# EAGLE design dip_version_ser_io_crystal_bold_02 (EAGLE 5.06)
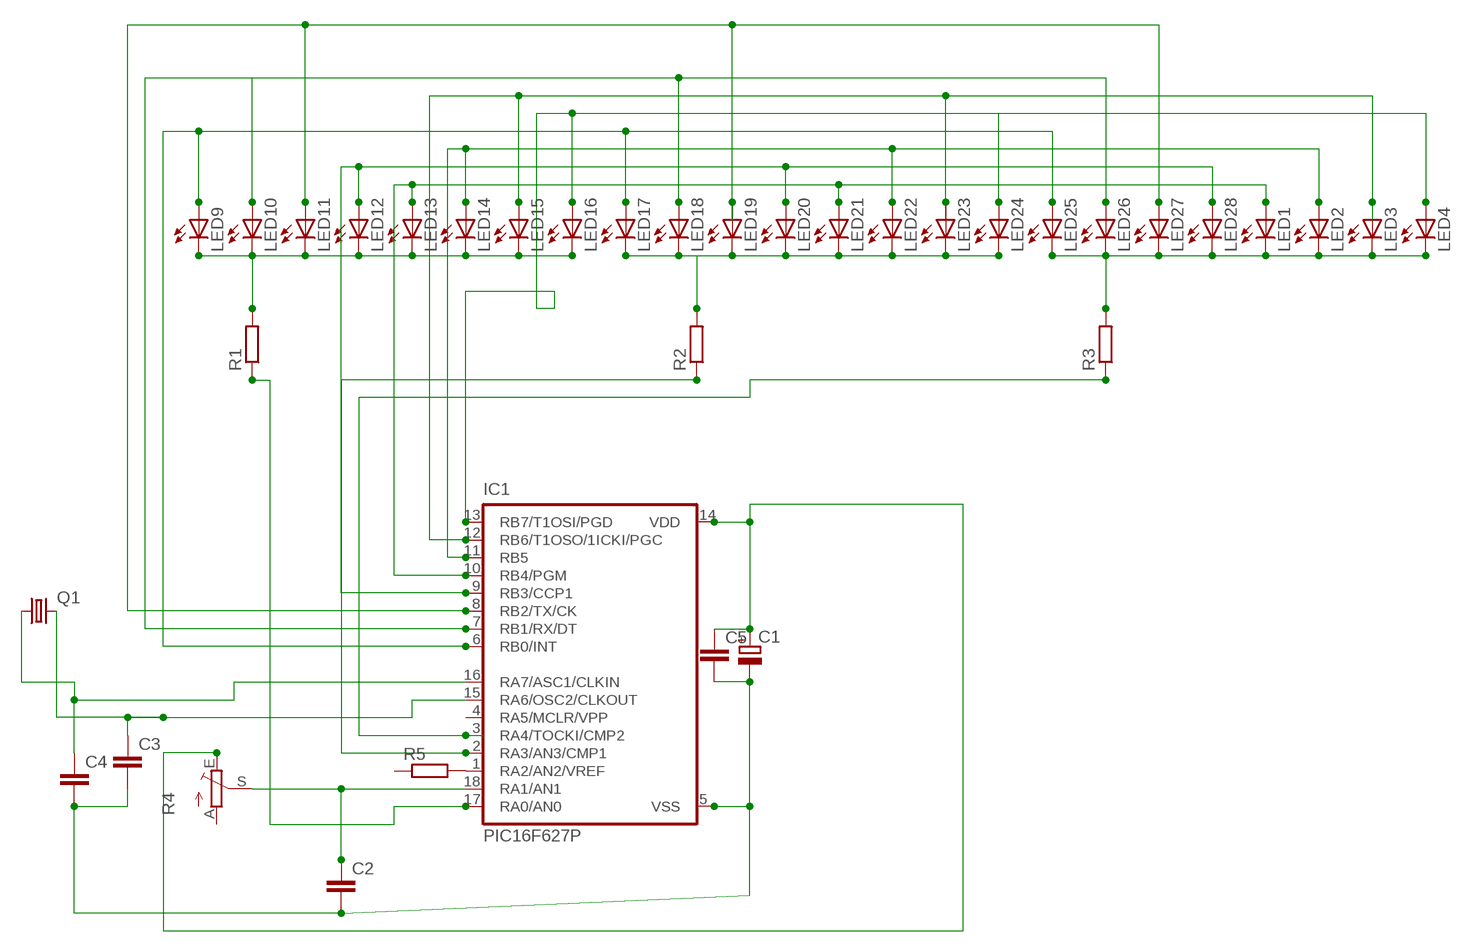
[diagram p0: schematic, sheet 1]

## Parts
C1  CPOL-EUTT6D6  [TT5D6]
C2  C-EU050-030X075  [C050-030X075]
C3  C5/2.5  [C5B2.5]
C4  C5/2.5  [C5B2.5]
C5  C7.5/4  [C7.5B4]
IC1  PIC16F627P  [DIL18]
LED1  LED5MM  [LED5MM]
LED2  LED5MM  [LED5MM]
LED3  LED5MM  [LED5MM]
LED4  LED5MM  [LED5MM]
LED9  LED5MM  [LED5MM]
LED10  LED5MM  [LED5MM]
LED11  LED5MM  [LED5MM]
LED12  LED5MM  [LED5MM]
LED13  LED5MM  [LED5MM]
LED14  LED5MM  [LED5MM]
LED15  LED5MM  [LED5MM]
LED16  LED5MM  [LED5MM]
LED17  LED5MM  [LED5MM]
LED18  LED5MM  [LED5MM]
LED19  LED5MM  [LED5MM]
LED20  LED5MM  [LED5MM]
LED21  LED5MM  [LED5MM]
LED22  LED5MM  [LED5MM]
LED23  LED5MM  [LED5MM]
LED24  LED5MM  [LED5MM]
LED25  LED5MM  [LED5MM]
LED26  LED5MM  [LED5MM]
LED27  LED5MM  [LED5MM]
LED28  LED5MM  [LED5MM]
Q1  CRYSTALHC49U-LM  [HC49U-LM]
R1  R-EU_0204/7  [0204/7]
R2  R-EU_0204/7  [0204/7]
R3  R-EU_0204/7  [0204/7]
R4  TRIM_EU-S43P  [SP19L]
R5  R-EU_0207/15  [0207/15]

## Nets
N$1: LED9.K(C) LED10.K(C) LED11.K(C) LED12.K(C) LED13.K(C) LED14.K(C) LED15.K(C) LED16.K(C) R1.2
N$2: IC1.6(RB0/INT) LED9.A LED17.A LED25.A
N$3: LED17.K(C) LED18.K(C) LED19.K(C) LED20.K(C) LED21.K(C) LED22.K(C) LED23.K(C) LED24.K(C) R2.2
N$4: LED1.K(C) LED2.K(C) LED3.K(C) LED4.K(C) LED25.K(C) LED26.K(C) LED27.K(C) LED28.K(C) R3.2
N$5: IC1.8(RB2/TX/CK) LED11.A LED19.A LED27.A
N$7: IC1.9(RB3/CCP1) LED12.A LED20.A LED28.A
N$8: IC1.10(RB4/PGM) LED1.A LED13.A LED21.A
N$9: IC1.11(RB5) LED2.A LED14.A LED22.A
N$10: IC1.12(RB6/T1OSO/1ICKI/PGC) LED3.A LED15.A LED23.A
N$11: IC1.13(RB7/T1OSI/PGD) LED4.A LED16.A LED24.A
N$12: IC1.17(RA0/AN0) R1.1
N$13: IC1.2(RA3/AN3/CMP1) R2.1
N$14: IC1.3(RA4/TOCKI/CMP2) R3.1
N$16: C1.+ C5.1 IC1.14(VDD) R4.E
N$17: C2.1 IC1.18(RA1/AN1) R4.S
N$18: IC1.1(RA2/AN2/VREF) R5.2
N$19: C4.1 IC1.16(RA7/ASC1/CLKIN) Q1.1
N$20: C3.1 IC1.15(RA6/OSC2/CLKOUT) Q1.2
N$21: IC1.7(RB1/RX/DT) LED10.A LED18.A LED26.A
N$31: C1.- C2.2 C3.2 C4.2 C5.2 IC1.5(VSS)
Unconnected: IC1.4(RA5/MCLR/VPP) R4.A R5.1

## Library data of the parts
C1 = rcl:CPOL-EU: POLARIZED CAPACITOR, European symbol
C2 = rcl:C-EU: CAPACITOR, European symbol
C3-C5 = capacitor-wima:C: CAPACITOR naming: grid - package width
IC1 = microchip:PIC16*F62: FLASH-Based 8-Bit CMOS Microcontroller Source: http://ww1.microchip.com/downloads/en/DeviceDoc/40300C.pdf
LED1-LED4 LED9-LED28 = led:LED: LED OSRAM: - CHIPLED LG R971, LG N971, LY N971, LG Q971, LY Q971, LO R971, LY R971 LH N974, LH R974 LS Q976, LO Q976, LY Q976 LO Q996 - Hyper CHIPLED LW Q18S LB Q993, LB Q99A, LB R99A - SideLED LS A670, LO A670, LY A670, LG A670, LP A670 LB A673, LV A673, LT A673, LW A673 LH A674 LY A675 LS A676, LA A676, LO A676, LY A676, LW A676 LS A679, LY A679, LG A679 - Hyper Micro SIDELED® LS Y876, LA Y876, LO Y876, LY Y876 LT Y87S - SmartLED LW L88C, LW L88S LB L89C, LB L89S, LG L890 LS L89K, LO L89K, LY L89K LS L896, LA L896, LO L896, LY L896 - TOPLED LS T670, LO T670, LY T670, LG T670, LP T670 LSG T670, LSP T670, LSY T670, LOP T670, LYG T670 LG T671, LOG T671, LSG T671 LB T673, LV T673, LT T673, LW T673 LH T674 LS T676, LA T676, LO T676, LY T676, LB T676, LH T676, LSB T676, LW T676 LB T67C, LV T67C, LT T67C, LS T67K, LO T67K, LY T67K, LW E67C LS E67B, LA E67B, LO E67B, LY E67B, LB E67C, LV E67C, LT E67C LW T67C LS T679, LY T679, LG T679 LS T770, LO T770, LY T770, LG T770, LP T770 LB T773, LV T773, LT T773, LW T773 LH T774 LS E675, LA E675, LY E675, LS T675 LS T776, LA T776, LO T776, LY T776, LB T776 LHGB T686 LT T68C, LB T68C - Hyper Mini TOPLED® LB M676 - Mini TOPLED Santana® LG M470 LS M47K, LO M47K, LY M47K Source: http://www.osram.convergy.de LUXEON: - LUMILED® LXK2-PW12-R00, LXK2-PW12-S00, LXK2-PW14-U00, LXK2-PW14-V00 LXK2-PM12-R00, LXK2-PM12-S00, LXK2-PM14-U00 LXK2-PE12-Q00, LXK2-PE12-R00, LXK2-PE12-S00, LXK2-PE14-T00, LXK2-PE14-U00 LXK2-PB12-K00, LXK2-PB12-L00, LXK2-PB12-M00, LXK2-PB14-N00, LXK2-PB14-P00, LXK2-PB14-Q00 LXK2-PR12-L00, LXK2-PR12-M00, LXK2-PR14-Q00, LXK2-PR14-R00 LXK2-PD12-Q00, LXK2-PD12-R00, LXK2-PD12-S00 LXK2-PH12-R00, LXK2-PH12-S00 LXK2-PL12-P00, LXK2-PL12-Q00, LXK2-PL12-R00 Source: www.luxeon.com KINGBRIGHT: KA-3528ASYC Source: www.kingbright.com
Q1 = crystal:CRYSTAL: CRYSTAL
R1-R3 R5 = resistor:R-EU_: RESISTOR, European symbol
R4 = pot:TRIM_EU-: POTENTIOMETER

## Board
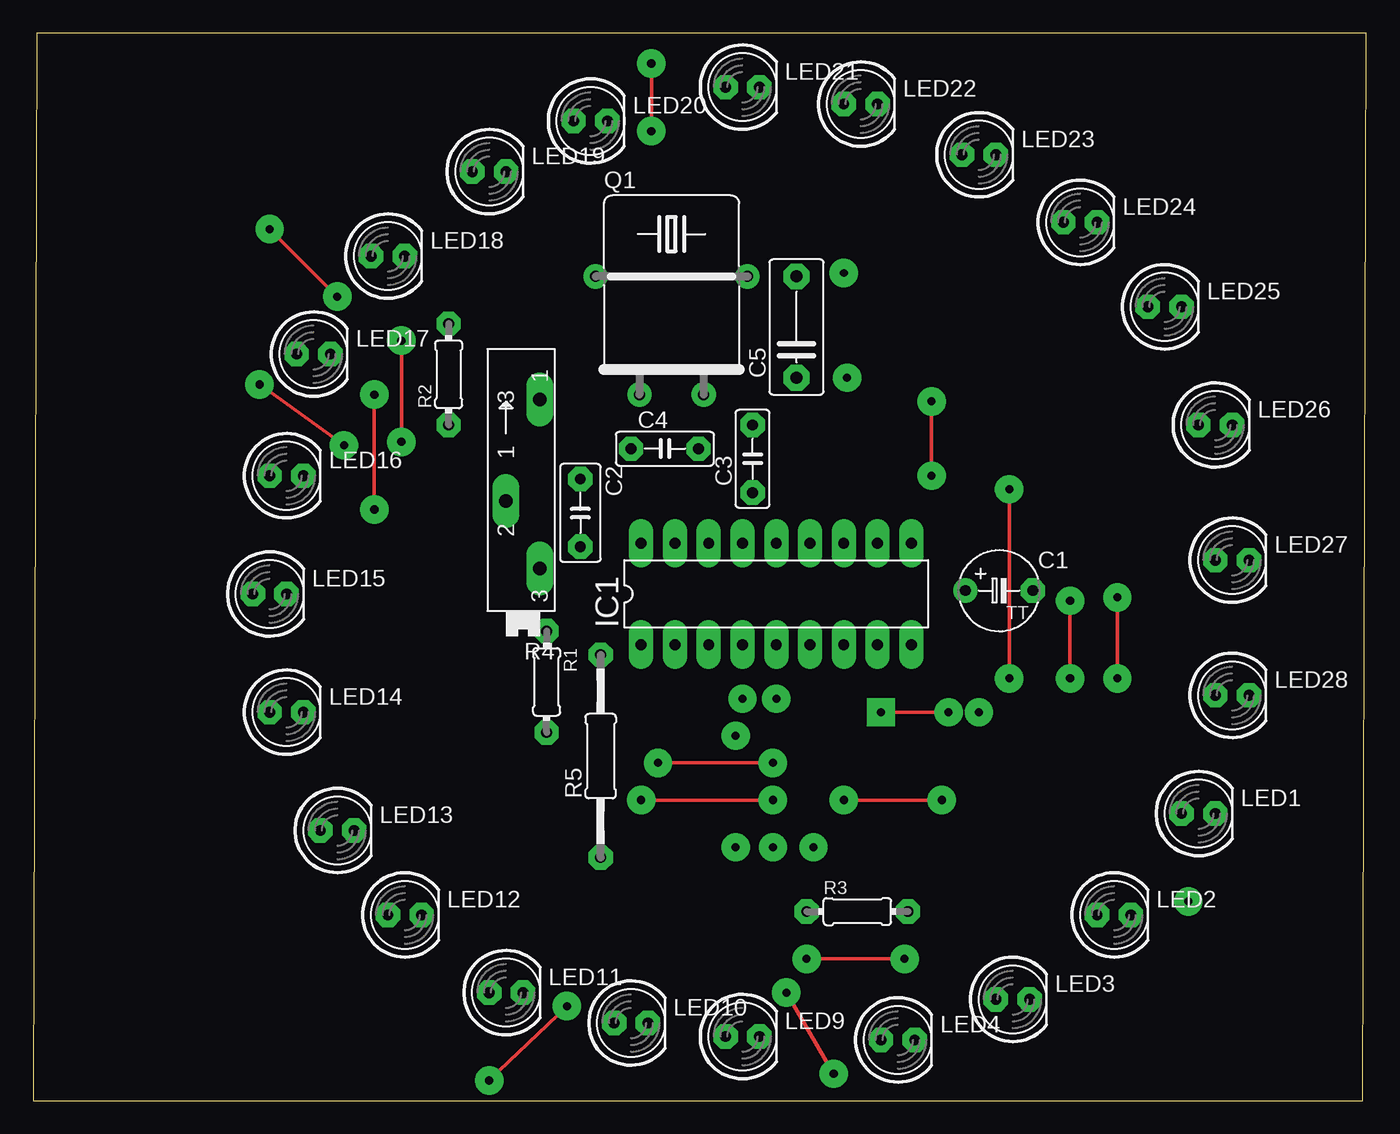
[diagram p1: board, top side]
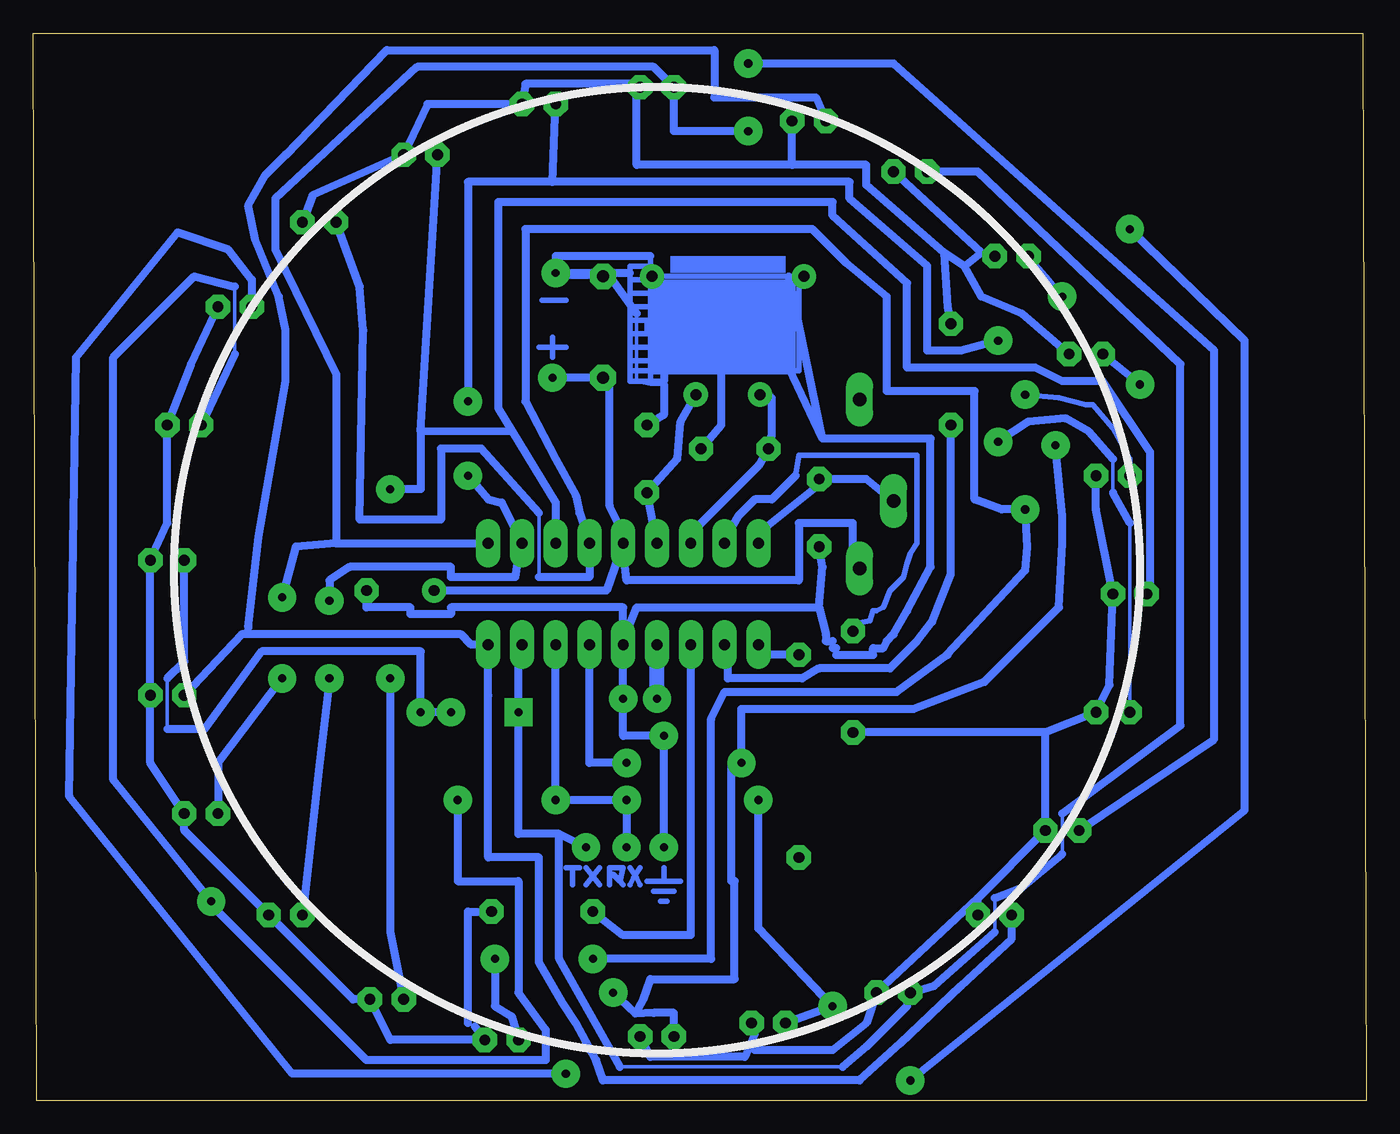
[diagram p2: board, bottom side, seen from below]

Size 100.25 x 80.25 mm. Coordinates in mm from the lower left corner, seen from the top.
Outline: 0,0 100,0 100.25,80.25 0.25,80.25 0,0
Copper layers (1*16): Top 0.035mm / dielectric 1.5mm / Bottom 0.035mm
Design rules "default *": minimum track width 10mil, minimum drill 24mil, track to track 8mil, track to pad 8mil, pad to pad 8mil, via to via 8mil, smd to smd 8mil, copper to edge 40mil, drill to drill 8mil, minimum pad ring 20mil, minimum via ring 30mil, stop-mask expansion 4mil, vias tented up to drill 0mil, thermal gap 10mil

### Footprints (pad centres in the part's own frame; a part is rotated, then mirrored left to right if it is on the bottom)
TT5D6 = drill 0.813 round: + -2.54,0 | drill 0.813 octagon: - 2.54,0
C050-030X075 = drill 0.813 octagon: 1 -2.54,0; 2 2.54,0
C5B2.5 = drill 0.813 pad 1.6 octagon: 1 -2.54,0; 2 2.54,0
C7.5B4 = drill 0.914 pad 1.905 octagon: 1 -3.81,0; 2 3.81,0
DIL18 = drill 0.813 long: 1 -10.16,-3.81; 2 -7.62,-3.81; 3 -5.08,-3.81; 4 -2.54,-3.81; 5 0,-3.81; 6 2.54,-3.81; 7 5.08,-3.81; 8 7.62,-3.81; 9 10.16,-3.81; 10 10.16,3.81; 11 7.62,3.81; 12 5.08,3.81; 13 2.54,3.81; 14 0,3.81; 15 -2.54,3.81; 16 -5.08,3.81; 17 -7.62,3.81; 18 -10.16,3.81
LED5MM = drill 0.813 octagon: A -1.27,0; K 1.27,0
HC49U-LM = drill 0.813 round: 1 -2.413,-5.08; 2 2.413,-5.08; M -5.715,3.81; M1 5.715,3.81
0204/7 = drill 0.813 octagon: 1 -3.81,0; 2 3.81,0
SP19L = drill 1.016 long: A 5.715,-1.27; E -6.985,-1.27; S -1.905,1.27
0207/15 = drill 0.813 octagon: 1 -7.62,0; 2 7.62,0

### Placement (x,y rotation side)
C1  72.64,38.35 0 top
C2  41.15,44.2 270 top
C3  54.1,48.26 90 top
C4  47.5,49.02 0 top
C5  57.4,58.17 90 top
IC1  55.88,38.1 0 top
LED1  87.63,21.59 0 top
LED2  81.28,13.97 0 top
LED3  73.66,7.62 0 top
LED4  65.02,4.57 0 top
LED9  53.34,4.83 0 top
LED10  44.96,5.84 0 top
LED11  35.56,8.13 0 top
LED12  27.94,13.97 0 top
LED13  22.86,20.32 0 top
LED14  19.05,29.21 0 top
LED15  17.78,38.1 0 top
LED16  19.05,46.99 0 top
LED17  21.08,56.13 0 top
LED18  26.67,63.5 0 top
LED19  34.29,69.85 0 top
LED20  41.91,73.66 0 top
LED21  53.34,76.2 0 top
LED22  62.23,74.93 0 top
LED23  71.12,71.12 0 top
LED24  78.74,66.04 0 top
LED25  85.09,59.69 0 top
LED26  88.9,50.8 0 top
LED27  90.17,40.64 0 top
LED28  90.17,30.48 0 top
Q1  48.01,58.17 0 top
R1  38.61,31.5 270 top
R2  31.24,54.61 90 top
R3  61.98,14.22 0 top
R4  36.83,46.99 90 top
R5  42.67,25.91 90 top

### Tracks (layer width: path | path; a pad name or v marks a point on that pad's centre or on a via)
N$1
  Bottom 0.254: 45.97,3.81 45.97,5.08
  Bottom 0.61: LED12.K 29.21,15.24 | 29.21,15.24 LED13.K 24.13,27.69 | 29.21,15.24 LED11.K 37.59,5.84 40.13,3.81 45.97,3.81 | 24.13,27.69 LED14.K 19.3,31.24 LED15.K 20.32,44.45 LED16.K | 24.13,27.69 R1.2 | LED9.K 53.85,3.3 46.74,3.3 45.97,5.08 LED10.K
N$2  (via drill 0.61)
  Top 0.254: v23.37,49.28 v17.02,53.85 | v46.99,25.4 v55.63,25.4 | v56.64,8.13 v60.2,2.03
  Bottom 0.254: 47.5,16.51 47.75,16.51
  Bottom 0.61: v17.02,53.85 LED17.A | IC1.6 58.42,25.4 v55.63,25.4 | v60.2,2.03 80.77,2.03 97.54,22.86 97.03,55.88 89.41,65.28 85.6,64.01 83.82,61.72 LED25.A | v23.37,49.28 22.86,43.94 22.86,41.91 23.11,37.08 28.7,31.5 34.04,29.46 46.99,29.46 v46.99,25.4 47.75,25.15 47.75,16.51 | 47.5,16.51 47.5,9.14 53.85,9.14 54.36,7.62 54.97,6.55 | 54.97,6.55 v56.64,8.13 | LED9.A 52.07,6.6 53.59,6.6 54.97,6.55
N$3
  Bottom 0.254: 28.96,63.75 LED18.K | 54.86,76.45 LED21.K
  Bottom 0.61: LED24.K 79.25,68.07 LED23.K 70.61,74.93 LED22.K 63.25,76.45 54.86,76.45 54.86,70.36 43.18,70.36 | LED17.K 25.91,59.18 28.96,60.45 30.23,62.74 | 30.23,62.74 28.96,63.75 LED19.K | 30.23,62.74 31.75,63.75 | 31.75,63.75 37.59,68.83 37.59,70.36 43.18,70.36 | 43.18,70.36 LED20.K | 31.75,63.75 31.5,59.69 R2.2
N$4
  Bottom 0.254: 67.06,5.59 67.56,5.84
  Bottom 0.61: LED25.K 88.39,55.37 LED26.K 90.17,43.43 LED27.K LED28.K 91.44,25.4 LED1.K 88.9,20.32 LED2.K 76.2,7.62 LED3.K 73.41,4.57 LED4.K 67.06,5.59 | 67.56,5.84 67.56,14.22 R3.2
N$5  (via drill 0.6, 0.6 pad 1.93, 0.61)
  Top 0.254: v63.75,29.21 v68.83,29.21
  Bottom 0.254: v63.75,29.21 IC1.8 | 22.86,18.54 22.86,21.59 | 27.94,12.7 27.94,15.24 | 90.17,27.94 90.17,31.75 | 37.59,4.06 37.67,4.14 | 39.37,2.54 56.13,2.54
  Bottom 0.61: LED19.A 29.21,69.85 13.97,55.37 13.97,28.19 22.86,21.59 | 22.86,18.54 25.91,16 27.94,15.24 | 27.94,12.7 32.51,8.64 LED11.A 34.54,7.11 37.59,4.06 39.37,2.54 | LED27.A 88.9,33.02 90.17,31.75 | 90.17,27.94 87.38,27.94 83.06,33.78 71.12,33.78 v71.12,29.21 v68.83,29.21 | IC1.8 63.75,33.53 v63.75,29.21 63.75,20.07 60.71,20.07 | 56.13,2.54 60.71,10.67 60.71,20.07 | 60.71,20.07 v58.67,19.05
N$6
  Bottom 0.406: 52.83,16.51 52.83,17.53 | 52.83,16.51 51.56,16.51 | 52.83,16.51 54.1,16.51
N$7
  Bottom 0.254: 84.58,35.05 84.07,35.56 | 81.28,71.12 81.25,71.08
  Bottom 0.61: LED28.A 84.58,35.05 68.07,35.05 67.31,34.29 IC1.9 66.04,30.48 66.04,18.29 62.23,18.29 62.23,10.41 60.45,7.37 59.44,5.84 57.91,3.05 57.4,1.52 38.1,1.52 35.05,4.32 30.48,8.64 26.67,12.19 LED12.A | 81.25,71.08 73.66,78.99 49.02,78.99 49.02,75.44 41.4,75.44 LED20.A | 81.28,71.12 82.8,69.6 84.07,67.31 83.57,64.77 81.79,60.45 81.28,57.91 81.28,54.1 83.31,42.42 84.07,35.56
N$8  (via drill 0.61)
  Top 0.254: v46.48,77.98 v46.48,72.9 | v81.53,37.85 v81.53,31.75
  Bottom 0.61: LED13.A 11.43,27.18 11.43,56.39 35.56,77.98 v46.48,77.98 | v46.48,72.9 52.07,72.9 LED21.A 53.59,77.72 71.37,77.72 82.04,67.82 82.04,64.01 77.47,54.61 77.47,41.91 | LED1.A 86.36,25.4 v81.53,31.75 | 77.47,41.91 IC1.10 | 77.47,41.91 80.52,41.66 v81.53,37.85
N$9  (via drill 0.61)
  Top 0.254: v77.98,37.59 v77.98,31.75 | v27.69,49.53 v27.69,57.15 | v67.56,52.58 v67.56,46.99
  Bottom 0.254: LED14.A 17.78,43.43 | 19.05,45.72 19.05,48.26
  Bottom 0.61: LED2.A 78.74,25.15 v77.98,31.75 | v67.56,46.99 66.04,45.21 65.02,44.96 IC1.11 63.75,41.15 64.01,39.37 68.83,39.37 68.83,40.13 76.45,40.13 77.98,39.12 v77.98,37.59 | 17.78,43.43 19.05,45.72 | 19.05,48.26 20.83,50.29 22.61,51.31 25.4,51.05 v27.69,49.53 | v67.56,52.58 67.56,69.09 61.21,69.09 | 61.21,69.09 LED22.A | 61.21,69.09 38.86,69.09 38.86,67.82 33.02,62.74 33.02,56.39 30.48,56.39 v27.69,57.15
N$10  (via drill 0.61)
  Top 0.254: v73.41,45.97 v73.41,31.75
  Bottom 0.254: 60.96,44.96 62.74,47.75 64.23,50.32 66.55,50.29 71.12,50.29 | LED15.A 16.26,38.61
  Bottom 0.61: LED3.A 73.41,12.7 v73.41,31.75 | 71.12,50.29 LED23.A | 64.23,50.32 71.12,50.29 | 16.26,38.61 16.26,48.77 19.81,54.1 22.86,54.1 24.89,55.12 34.54,55.12 34.54,61.47 40.13,66.55 40.13,67.56 65.28,67.56 65.28,52.07 60.96,44.96 IC1.12 | 71.12,50.29 71.12,45.97 v73.41,45.97
N$11  (via drill 0.61)
  Top 0.254: v25.65,44.45 v25.65,53.09 | v58.17,10.67 v65.53,10.67
  Bottom 0.254: 62.23,39.37 62.23,44.2 | 31.5,33.53 31.52,33.55
  Bottom 0.406: LED16.A 17.78,48.26 19.05,50.55 20.57,52.32 21.08,52.32 23.11,52.83 v25.65,53.09
  Bottom 0.61: v65.53,10.67 65.53,7.11 64.26,6.35 LED4.A | v58.17,10.67 49.28,10.67 49.28,28.7 48.26,30.73 35.31,30.73 31.5,33.53 | LED24.A 75.69,61.21 75.44,57.91 75.69,43.69 69.6,43.69 69.6,49.02 66.55,49.02 62.23,44.2 | 62.23,39.37 58.42,39.37 IC1.13 59.18,44.2 59.44,45.47 60.96,48.26 63.25,52.58 63.25,65.53 41.66,65.53 39.12,62.99 36.07,60.45 36.07,53.34 29.46,53.34 29.46,45.21 27.43,44.45 v25.65,44.45 25.5,41.63 25.65,39.88 31.52,33.55
N$12
  Bottom 0.406: 48.01,42.67 IC1.17 | 42.93,46.99 42.67,48.51 33.78,48.51 33.78,41.91 34.29,41.15 34.54,40.39 34.8,39.37 35.81,38.35 36.32,37.08 36.83,36.83 37.08,36.83 37.34,36.07 38.61,35.81 R1.1
  Bottom 0.61: 48.01,42.67 47.24,43.94 45.97,45.21 44.7,45.21 42.93,46.99
N$13
  Bottom 0.61: IC1.2 48.01,33.53 48.01,31.75 42.42,31.75 41.15,32.51 35.81,32.51 33.78,34.54 32.66,36 31.24,39.62 R2.1
N$14
  Bottom 0.61: IC1.3 50.8,12.45 55.88,12.45 R3.1
N$15
  Bottom 0.406: 60.2,56.64 62.23,56.64
N$16  (via drill 0.6 pad 1.93)
  Bottom 0.254: 55.88,41.66 IC1.14 | 56.9,53.85 C5.1
  Bottom 0.61: C1.+ 57.15,38.35 IC1.14 55.88,42.67 56.9,44.7 56.9,53.85 | 55.88,41.66 55.63,39.12 42.67,39.12 42.67,43.43 38.61,43.43 38.61,40.64 R4.E | C5.1 v61.21,54.36
N$17
  Bottom 0.254: 45.72,42.67 IC1.18 | 40.64,46.74 C2.1
  Bottom 0.61: 45.72,42.67 40.64,46.74 37.59,46.74 R4.S
N$18
  Bottom 0.61: R5.2 45.72,33.53 IC1.1
N$19
  Bottom 0.254: 50.8,42.67 IC1.16
  Bottom 0.61: Q1.1 44.7,52.83 44.7,50.04 C4.1 45.72,47.75 50.8,42.67
N$20
  Bottom 0.61: IC1.15 C3.1 51.82,48.26 51.56,51.05 Q1.2
N$21  (via drill 0.6 pad 1.93, 0.61)
  Top 0.254: v60.96,22.61 v68.33,22.61 | v45.72,22.61 v55.63,22.61 | v34.29,1.52 v40.13,7.11 | v17.78,65.53 v22.86,60.45
  Bottom 0.254: 85.09,61.21 85.09,56.13 | v55.63,22.61 v60.96,22.61 | 86.36,14.22 v86.87,14.99
  Bottom 0.406: LED18.A 23.88,61.72 v22.86,60.45
  Bottom 0.61: IC1.7 v60.96,22.61 v55.63,22.61 v55.63,19.05 | v86.87,14.99 94.23,24.13 94.23,55.88 88.14,61.98 85.09,61.21 | 85.09,56.13 LED26.A | v17.78,65.53 9.14,57.15 9.14,21.84 v34.29,1.52 | LED10.A v40.13,7.11 45.72,12.95 v45.72,22.61 | v68.33,22.61 68.33,16.51 63.75,16.51 63.75,8.13 61.72,5.33 61.72,3.05 75.18,3.05 86.36,14.22
N$22  (via drill 0.6 pad 1.93)
  Bottom 0.406: 53.59,30.23 v53.34,30.23 53.09,30.23 | 53.09,35.05 53.59,35.05
  Bottom 0.61: 53.59,30.23 53.59,35.05 | 53.09,30.23 53.09,35.05
N$23
  Bottom 0.406: 52.07,15.75 53.59,15.75
N$24
  Bottom 0.406: 53.09,14.99 52.58,14.99
N$25
  Bottom 0.406: 59.69,17.53 59.18,17.53 | 59.69,17.53 60.2,17.53 | 59.69,16.26 59.69,17.53
N$26
  Bottom 0.406: 57.66,16.26 58.67,17.53
N$27
  Bottom 0.406: 57.66,17.53 58.67,16.26
N$28
  Bottom 0.406: 56.9,16.26 56.9,17.53 55.88,17.53 56.13,16.51 | 56.13,16.51 56.64,17.02 | 55.88,16.26 56.13,16.51
N$29
  Bottom 0.406: 55.37,17.53 54.86,16.76 54.61,16.26
N$30
  Bottom 0.406: 55.37,16.26 55.12,16.76 54.61,17.53
N$31  (via drill 0.6 pad 1.93)
  Bottom 0.254: IC1.5 55.88,34.54 | 47.75,55.12 48.51,55.12 | 47.75,55.12 52.83,55.12 | 52.83,54.1 52.83,53.85 53.85,53.85 54.86,54.1 54.86,59.18 | 43.43,55.12 47.75,55.12 | 39.88,34.04 39.88,33.53 | 40.13,34.54 40.13,34.04 | 56.9,61.98 C5.2
  Bottom 0.406: 42.67,61.98 42.42,61.98 | 53.85,61.98 43.43,61.98 42.67,61.98 | 53.85,61.98 53.85,61.72 | 53.85,61.72 53.85,60.71 | 53.85,59.94 53.85,57.66 | 53.85,57.66 53.85,56.64 | 53.85,56.13 53.85,54.86 | 53.85,54.86 42.67,54.86 42.67,61.98 | C5.2 60.96,61.98 v60.96,62.23 | 53.85,61.98 53.85,62.74 | 53.85,62.74 53.85,63.5 | 55.37,62.23 55.37,61.72 | 55.37,60.71 55.37,59.69 | 55.37,58.67 55.37,57.66 | 55.37,56.39 55.37,55.63 | 55.37,55.63 55.37,54.1 52.83,54.1 53.85,54.1 53.85,54.86 | 53.85,54.86 55.37,54.86 55.37,55.63 | 55.37,55.63 53.85,55.63 53.85,56.13 | 53.85,56.13 53.85,56.64 | 53.85,56.64 55.37,56.64 55.37,56.39 | 55.37,56.39 55.37,57.66 | 55.37,57.66 53.85,57.66 | 53.85,57.66 54.1,57.66 54.1,58.67 55.37,58.67 | 55.37,58.67 55.37,59.69 | 55.37,59.69 53.85,59.69 53.85,59.94 | 53.85,59.94 53.85,60.71 | 53.85,60.71 55.37,60.71 | 55.37,60.71 55.37,61.72 | 55.37,61.72 53.85,61.72 | 53.85,61.72 53.85,62.74 | 53.85,62.74 55.37,62.74 55.37,62.48
  Bottom 0.61: C1.- 75.18,37.08 71.88,37.08 71.88,36.58 68.83,36.58 68.83,37.08 55.88,37.08 55.88,34.54 54.86,37.08 41.15,37.08 | 41.15,37.08 40.89,40.13 C2.2 | 48.51,55.12 48.51,50.8 C4.2 | 52.83,55.12 52.83,54.1 | 52.83,53.85 52.83,51.56 C3.2 | 40.89,49.78 43.43,55.12 | 40.89,49.78 32.77,49.78 32.77,40.13 34.54,36.83 35.56,35.05 36.07,34.54 36.32,34.04 37.08,34.04 37.08,33.53 39.88,33.53 | 40.13,34.04 39.88,34.04 | 40.13,34.54 40.64,34.54 40.64,35.05 41.15,37.08 | IC1.5 v55.88,30.23 55.88,27.43 v52.83,27.43 v52.83,19.05 | 40.89,49.78 43.43,61.98 | 54.86,59.18 56.9,61.98 | 53.85,63.5 60.96,63.5 v60.96,62.23 55.37,62.23
N$32
  Bottom 0.406: 61.21,57.4 61.21,55.88
N$33
  Bottom 0.406: 60.2,60.2 61.98,60.2
(copper drawn outside any net)
  shapes: Bottom area x2